# Altium project PCB_GTIL_WIFI_MODULE.PrjPcb
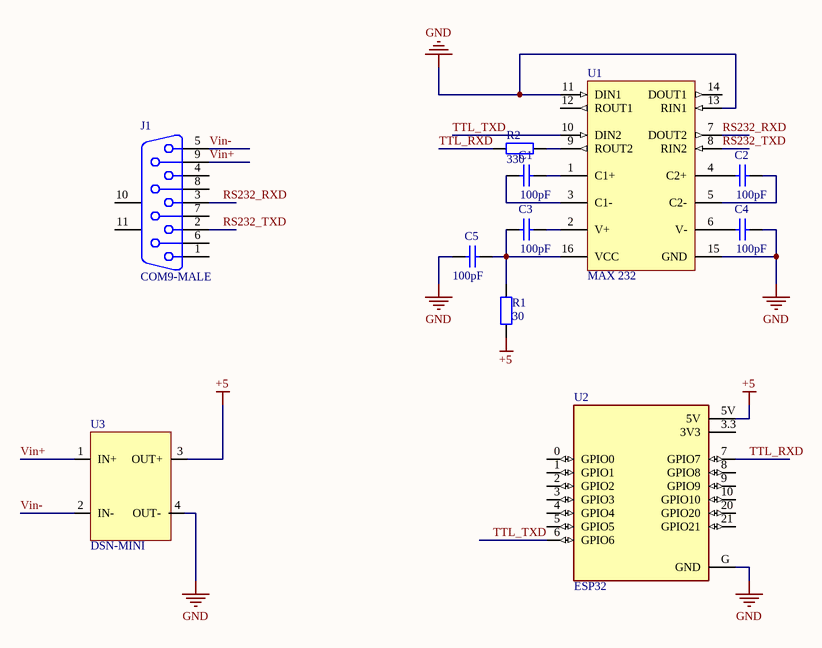
[diagram p0: Schematic.SchDoc]
1 sheet, 11 parts. Net scope: global (net labels, ports and power ports of the same name join across sheets).
Board file: PCB_GTIL_WIFI.PcbDoc

## Sheet Schematic.SchDoc
size A; SheetNumber: 1; SheetTotal: 1

### Parts
C1  value 100pF  [C1206]  (hidden comment: Cap Semi)
C2  value 100pF  [C1206]  (hidden comment: Cap Semi)
C3  value 100pF  [C1206]  (hidden comment: Cap Semi)
C4  value 100pF  [C1206]  (hidden comment: Cap Semi)
C5  value 100pF  [C1206]  (hidden comment: Cap Semi)
J1  COM9-MALE  [DSUB1.385-2H9]
R1  30  [RESC-1206 (3216)]
R2  330  [RESC-1206 (3216)]
U1  MAX 232  [SOIC-16]
U2  ESP32  [MODULE_ESP32-C3_SUPERMINI]
U3  DSN-MINI  [PCBComponent_1]

### Nets
+5: R1.1 U2.5V U3.3(OUT+)
GND: C4.2 C5.1 U1.11(DIN1) U1.13(RIN1) U1.15(GND) U2.G(GND) U3.4(OUT-)
RS232_RXD: J1.3 U1.7(DOUT2)
RS232_TXD: J1.2 U1.8(RIN2)
TTL_RXD: R2.2 U2.7(GPIO7)
TTL_TXD: U1.10(DIN2) U2.6(GPIO6)
Vin+: J1.9 U3.1(IN+)
Vin-: J1.5 U3.2(IN-)
NetC1_1: C1.1 U1.3(C1-)
NetC1_2: C1.2 U1.1(C1+)
NetC2_1: C2.1 U1.4(C2+)
NetC2_2: C2.2 U1.5(C2-)
NetC3_1: C3.1 C5.2 R1.2 U1.16(VCC)
NetC3_2: C3.2 U1.2(V+)
NetC4_1: C4.1 U1.6(V-)
NetR2_1: R2.1 U1.9(ROUT2)

Not connected (* = marked no-connect by the designer): J1 1 4 6 7 8 10(MH1) 11(MH2); U1 12(ROUT1) 14(DOUT1); U2 0(GPIO0) 1(GPIO1) 2(GPIO2) 3(GPIO3) 3.3(3V3) 4(GPIO4) 5(GPIO5) 8(GPIO8) 9(GPIO9) 10(GPIO10) 20(GPIO20) 21(GPIO21)

### Library data of the parts
C1-C5 = Cap Semi: Capacitor (Semiconductor SIM Model); Published: 8-Jun-2000; LatestRevisionDate: 29-May-2009; LatestRevisionNote: IPC-7351 Footprint Added.; PackageReference: C1206; Publisher: Altium Limited; PackageDescription: Chip Capacitor
J1 = D Connector 9: Receptacle Assembly, 9 Position, Right Angle; PackageDocument: O; Positions: 9; Published: 15-Jun-2001; LatestRevisionDate: 17-Jul-2002; LatestRevisionNote: Re-released for DXP Platform.; DatasheetDocument: 1-Sep-1999; PackageReference: 788750; Publisher: Altium Limited; Orientation: Right Angle; Gender: Receptacle
R1 R2 = RC1206JR-070RL: RES SMD 0.0 OHM JUMPER 1/4W 1206; CompanyID: VT-01082; Solder: SMT; Value: 0R; MPN: RC1206JR-070RL; Category: RESISTOR
U1 = MAX3232CDRE4, MAX3232CDR: IC DRVR/RCVR MULTCH RS232 16SOIC; Solder: SMT; MPN: MAX3232CDRE4, MAX3232CDR; Value: MAX 232; Category: IC
U2 = ESP32-C3_SUPERMINI: Super tiny ESP32-C3 board; MF: Espressif Systems; MP: ESP32-C3 SuperMini; SnapEDA_Link: https://www.snapeda.com/parts/ESP32-C3%20SuperMini/Espressif+Systems/view-part/?ref=snap; Package: Package; Value: *; Check_prices: https://www.snapeda.com/parts/ESP32-C3%20SuperMini/Espressif+Systems/view-part/?ref=eda